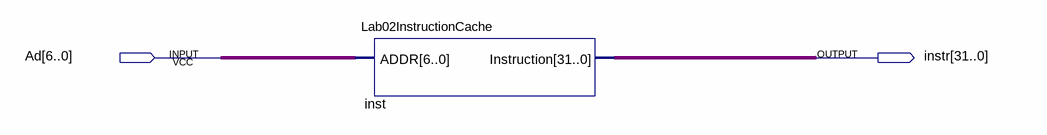
[diagram p0: schematic sheet]
// Quartus schematic InstructionCache.bdf as structural Verilog: 1 symbols, 2 pins
module InstructionCache (
  input  [6:0] Ad,
  output [31:0] instr
);

  Lab02InstructionCache inst (.ADDR(Ad), .Instruction(instr));
endmodule
